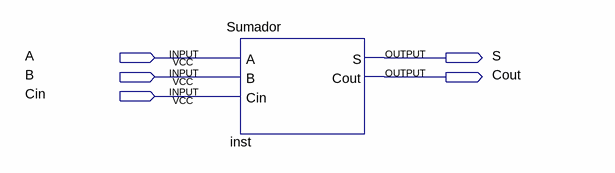
[diagram p0: schematic sheet]
// Quartus schematic SumadorBlock2.bdf as structural Verilog: 1 symbols, 5 pins
module SumadorBlock2 (
  input  A,
  input  B,
  input  Cin,
  output S,
  output Cout
);

  Sumador inst (.A(A), .B(B), .Cin(Cin), .S(S), .Cout(Cout));
endmodule
